# EasyEDA schematic SCH_RFID-ARDUINO-FABLAB-BG-v2_2024-03-10.json
TITLE: RFID_Arduino; REV: 0.2; Date: 2024-03-10; Sheet: 1/1; Drawn By: pascal.brunot; Company: FABLAB Bergamo
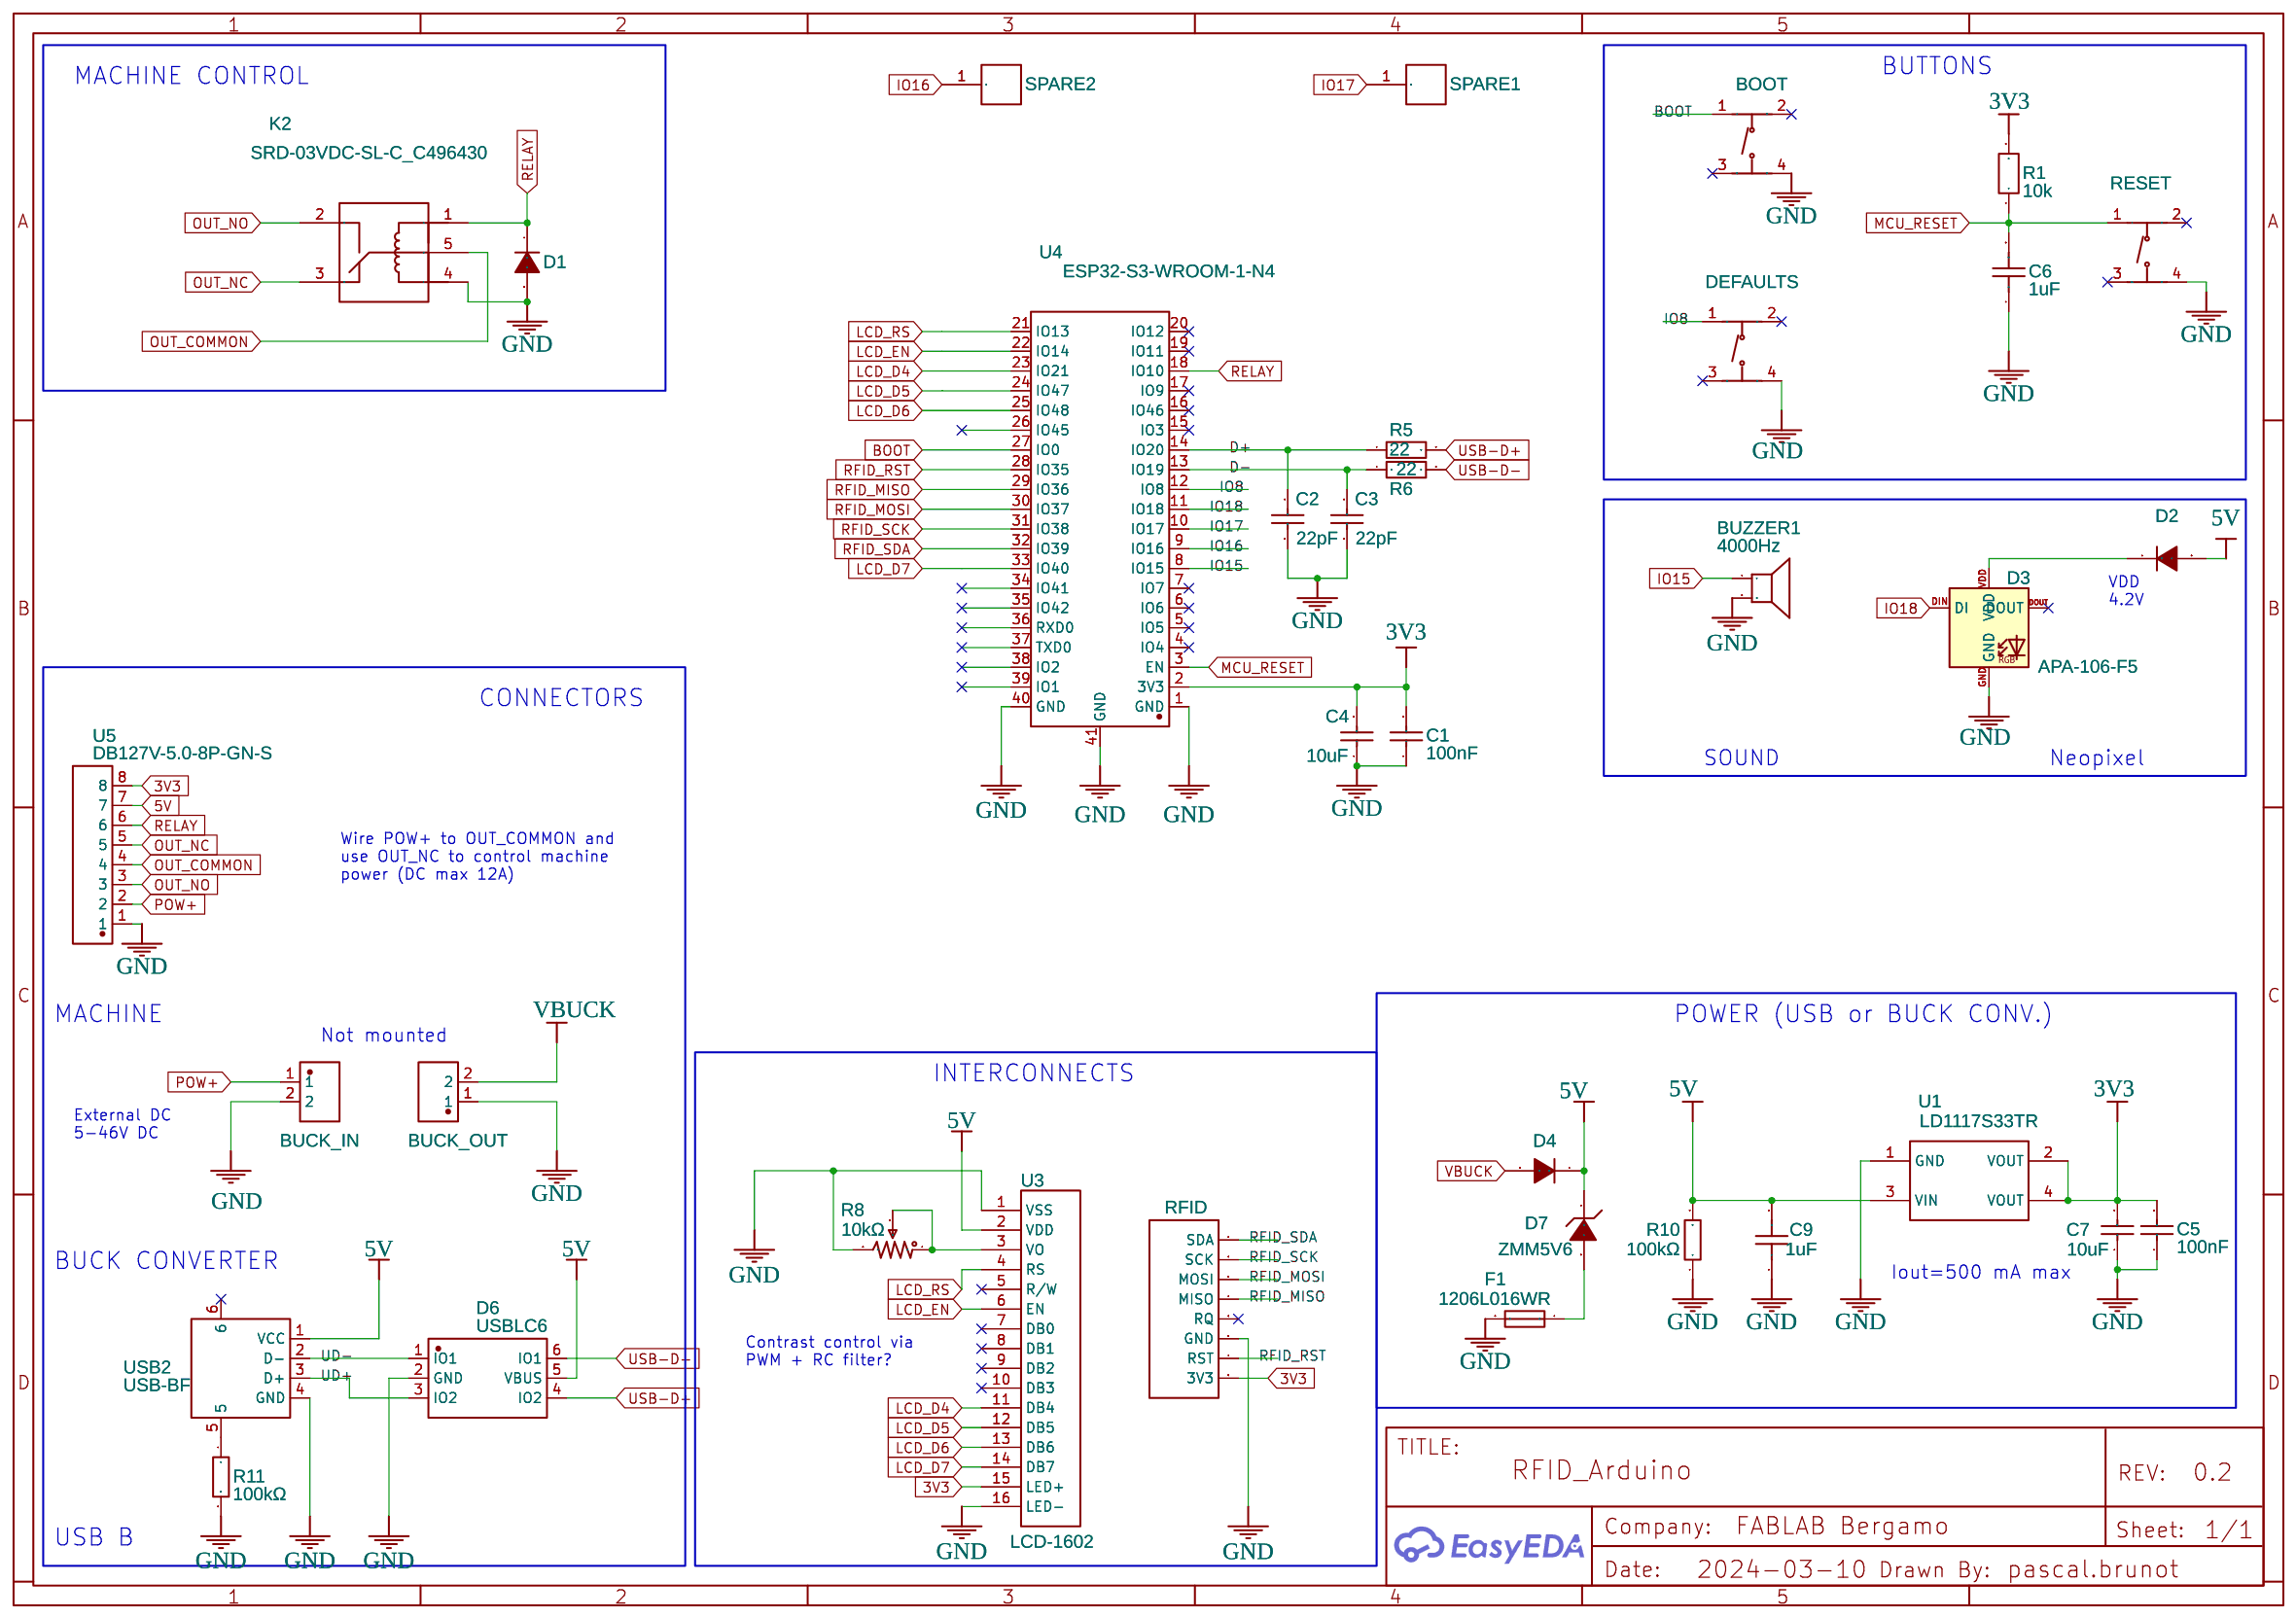
[diagram p0: schematic sheet]

## Parts
BOOT  TS-1187A-B-A-B  [SW-SMD_4P-L5.1-W5.1-P3.70-LS6.5-TL-2]
BUCK_IN  KF128L-3.81-2P  [CONN-TH_P3.81_KF128L-3.81-2P]
BUCK_OUT  KF128L-3.81-2P  [CONN-TH_P3.81_KF128L-3.81-2P]
BUZZER1  4000Hz  [BUZ-TH_BD12.5-P6.50-D0.9]
C1  100nF  [C0805]
C2  22pF  [C0402]
C3  22pF  [C0402]
C4  10uF  [C1206]
C5  100nF  [C0805]
C6  1uF  [C1206]
C7  10uF  [C1206]
C9  1uF  [C1206]
D1  SM4007PL  [SOD-123F_L2.8-W1.8-LS3.7-RD]
D2  SM4007PL  [SOD-123F_L2.8-W1.8-LS3.7-RD]
D3  APA-106-F5  [LED-TH_BD5.8-P2.28-FD-ADDRESSABLE]
D4  SM4007PL  [SOD-123F_L2.8-W1.8-LS3.7-RD]
D6  USBLC6  [SOT-23-6_L2.9-W1.6-P0.95-LS2.8-BL]
D7  ZMM5V6  [LL-34_L3.5-W1.5-RD]
DEFAULTS  TS-1187A-B-A-B  [SW-SMD_4P-L5.1-W5.1-P3.70-LS6.5-TL-2]
F1  1206L016WR  [F1206]
K2  SRD-03VDC-SL-C_C496430  [RELAY-TH_SRD-03VDC-SL-C]
P1  RFID  [RFID-RC522]
R1  10k  [R0603]
R5  22  [R0603]
R6  22  [R0603]
R8  10kΩ  [RES-ADJ-SMD_3P-L3.0-W3.8-P1.75-BR]
R10  100kΩ  [R0805]
R11  100kΩ  [R0805]
RESET  TS-1187A-B-A-B  [SW-SMD_4P-L5.1-W5.1-P3.70-LS6.5-TL-2]
SPARE1  0577-0-43-80-21-27-10-0  [TESTPOINT-TH_D0.5_0577-0-43-80-21-27-10-0]
SPARE2  0577-0-43-80-21-27-10-0  [TESTPOINT-TH_D0.5_0577-0-43-80-21-27-10-0]
U1  LD1117S33TR  [SOT-223_L6.5-W3.5-P2.30-LS7.0-BR]
U3  LCD-1602  [LCD-1602]
U4  ESP32-S3-WROOM-1-N4  [WIFIM-SMD_ESP32-S3-WROOM-1-N8]
U5  DB127V-5.0-8P-GN-S  [CONN-TH_8P-P5.00_DB127V-5.0-8P-GN-S]
USB2  USB-BF  [USB-B-TH_67068-8000]

## Library data of the parts
BOOT DEFAULTS RESET = TS-1187A-B-A-B: Supplier: LCSC; Supplier Part: C318884; Manufacturer: XKB Connectivity(中国星坤); Contributor: LCSC; JLCPCB Part Class: Basic Part
BUCK_IN BUCK_OUT = KF128L-3.81-2P: Supplier: LCSC; Supplier Part: C474932; Manufacturer: KEFA(科发); Contributor: LCSC; JLCPCB Part Class: Extended Part
BUZZER1 = SFN-12055PA6.5: Contributor: LCSC; Supplier: LCSC; Supplier Part: C360607; Manufacturer: S&S(海旭); JLCPCB Part Class: Extended Part
C1 C5 = CL21B104KCFNNNE: Supplier: LCSC; Manufacturer: SAMSUNG(三星); Supplier Part: C28233; JLCPCB Part Class: Basic Part
C2 C3 = 0402CG220J500NT: Supplier: LCSC; Manufacturer: FH(风华); Supplier Part: C1555; JLCPCB Part Class: Basic Part
C4 C7 = CL31A106KBHNNNE: Supplier: LCSC; Manufacturer: SAMSUNG(三星); Supplier Part: C13585; JLCPCB Part Class: Basic Part
C6 C9 = CL31B105KBHNNNE: Supplier: LCSC; Manufacturer: SAMSUNG(三星); Supplier Part: C1848; JLCPCB Part Class: Basic Part
D1 D2 D4 = SM4007PL: Supplier: LCSC; Manufacturer: MDD; Supplier Part: C64898; JLCPCB Part Class: Basic Part
D3 = APA-106-F5 COPY: Contributor: Jero Ahumada
D6 = USBLC6-2SC6_C2827654: Supplier: LCSC; Supplier Part: C2827654; Manufacturer: TECH PUBLIC(台舟); Manufacturer Part: USBLC6-2SC6; Contributor: LCSC; JLCPCB Part Class: Extended Part
D7 = ZMM5V6: Supplier: LCSC; Manufacturer Part: ZMM5V6-M; Manufacturer: ST(先科); Supplier Part: C8062; JLCPCB Part Class: Extended Part
F1 = 1206L016WR: Contributor: LCSC; Supplier: LCSC; Supplier Part: C151161; Manufacturer: Littelfuse(美国力特); JLCPCB Part Class: Extended Part
K2 = SRD-03VDC-SL-C_C496430: Contributor: LCSC; Supplier: LCSC; Supplier Part: C496430; Manufacturer: 松乐; Manufacturer Part: SRD-03VDC-SL-C; JLCPCB Part Class: Extended Part
P1 = RFID2: Supplier Part: C27438; Supplier: LCSC; Manufacturer: BOOMELE; Manufacturer Part: Female headerHDR1X8-2.54; Contributor: mayurharge
R1 = R_0603_EU: Supplier Part: C17414; Supplier: LCSC; Contributor: LCEDA_Lib; Manufacturer Part: 0805W8F1002T5E; Manufacturer: UNI-ROYAL(厚声)
R5 R6 = 0603WAF220JT5E: Supplier: LCSC; Manufacturer: UNI-ROYAL(厚声); Supplier Part: C23345; JLCPCB Part Class: Basic Part
R8 = TC33X-2-103E: Contributor: LCSC; Supplier: LCSC; Supplier Part: C719176; Manufacturer: BOURNS; JLCPCB Part Class: Extended Part
R10 R11 = 0805W8F1003T5E_C149504: Contributor: LCSC; Supplier: LCSC; Supplier Part: C149504; Manufacturer: UNI-ROYAL(厚声); Manufacturer Part: 0805W8F1003T5E; JLCPCB Part Class: Basic Part
SPARE1 SPARE2 = 0577-0-43-80-21-27-10-0: Supplier: LCSC; Supplier Part: C2895400; Manufacturer: null; JLCPCB Part Class: Extended Part; Contributor: LCSC
U1 = LD1117S33TR: Contributor: LCSC; Supplier: LCSC; Supplier Part: C86781; Manufacturer: ST(意法半导体); JLCPCB Part Class: Extended Part
U3 = -: Contributor: layout; sourceId: dpjdvN5Zh; Manufacturer Part: ?
U4 = ESP32-S3-WROOM-1-N4: Supplier: LCSC; Supplier Part: C2913197; Manufacturer: ESPRESSIF(乐鑫); JLCPCB Part Class: Extended Part; Contributor: lcsc
U5 = DB127V-5.0-8P-GN-S: Contributor: LCSC; Supplier: LCSC; Supplier Part: C430626; Manufacturer: DORABO(地博电气); JLCPCB Part Class: Extended Part
USB2 = USB-BF: Contributor: LCSC; Supplier: LCSC; Supplier Part: C114097; Manufacturer: MOLEX; Manufacturer Part: 670688000; JLCPCB Part Class: Extended Part

## Nets
3V3: C1.2 C4.2 C5.2 C7.2 P1.8(3V3) R1.2 U1.2(VOUT) U1.4(VOUT) U3.15(LED+) U4.2(3V3) U5.8
5V: C9.2 D2.2(A) D4.1(C) D6.5(VBUS) D7.1(C) R10.2 U1.3(VIN) U3.2(VDD) U5.7 USB2.1(VCC)
GND: BOOT.4(D) BUCK_IN.2 BUCK_OUT.1 BUZZER1.2 C1.1 C2.1 C3.1 C4.1 C5.1 C6.1 C7.1 C9.1 D1.2(A) D3.GND D6.2(GND) DEFAULTS.4(D) F1.2 K2.4 P1.6(GND) R8.3 R10.1 R11.2 RESET.4(D) U1.1(GND) U3.1(VSS) U3.16(LED-) U4.1(GND) U4.40(GND) U4.41(GND) U5.1 USB2.4(GND)
BOOT: BOOT.1(A) U4.27(IO0)
D+: C2.2 R5.1 U4.14(IO20)
D-: C3.2 R6.1 U4.13(IO19)
IO8: DEFAULTS.1(A) U4.12(IO8)
IO15: BUZZER1.1 U4.8(IO15)
IO16: SPARE2.1 U4.9(IO16)
IO17: SPARE1.1 U4.10(IO17)
IO18: D3.DIN(DI) U4.11(IO18)
LCD_D4: U3.11(DB4) U4.23(IO21)
LCD_D5: U3.12(DB5) U4.24(IO47)
LCD_D6: U3.13(DB6) U4.25(IO48)
LCD_D7: U3.14(DB7) U4.33(IO40)
LCD_EN: U3.6(EN) U4.22(IO14)
LCD_RS: U3.4(RS) U4.21(IO13)
MCU_RESET: C6.2 R1.1 RESET.1(A) U4.3(EN)
OUT_COMMON: K2.5 U5.4
OUT_NC: K2.3 U5.5
OUT_NO: K2.2 U5.3
POW+: BUCK_IN.1 U5.2
RELAY: D1.1(C) K2.1 U4.18(IO10) U5.6
RFID_MISO: P1.4(MISO) U4.29(IO36)
RFID_MOSI: P1.3(MOSI) U4.30(IO37)
RFID_RST: P1.7(RST) U4.28(IO35)
RFID_SCK: P1.2(SCK) U4.31(IO38)
RFID_SDA: P1.1(SDA) U4.32(IO39)
UD+: D6.3(IO2) USB2.3(D+)
UD-: D6.1(IO1) USB2.2(D-)
USB-D+: D6.4(IO2) R5.2
USB-D-: D6.6(IO1) R6.2
VBUCK: BUCK_OUT.2 D4.2(A)
Net-(D2-1): D2.1(C) D3.VDD
Net-(D7-2): D7.2(A) F1.1
Net-(R8-1): R8.1 R8.2 U3.3(VO)
Net-(R11-1): R11.1 USB2.5

Not connected (* = marked no-connect by the designer): BOOT 2(B)* 3(C)*; D3 DOUT*; DEFAULTS 2(B)* 3(C)*; P1 5(RQ)*; RESET 2(B)* 3(C)*; U3 5(R/W)* 7(DB0)* 8(DB1)* 9(DB2)* 10(DB3)*; U4 4(IO4)* 5(IO5)* 6(IO6)* 7(IO7)* 15(IO3)* 16(IO46)* 17(IO9)* 19(IO11)* 20(IO12)* 26(IO45) 34(IO41) 35(IO42) 36(RXD0) 37(TXD0) 38(IO2) 39(IO1); USB2 6*

## Notes on the sheet
- TODO:
  -
- MACHINE CONTROL
- BUTTONS
- VDD
  4.2V
- CONNECTORS
- SOUND
- Neopixel
- Wire POW+ to OUT_COMMON and
  use OUT_NC to control machine
  power (DC max 12A)
- MACHINE
- POWER (USB or BUCK CONV.)
- Not mounted
- INTERCONNECTS
- External DC
  5-46V DC
- BUCK CONVERTER
- Iout=500 mA max
- Contrast control via
  PWM + RC filter?
- USB B
